# EAGLE design adapter (EAGLE 9.2.1)
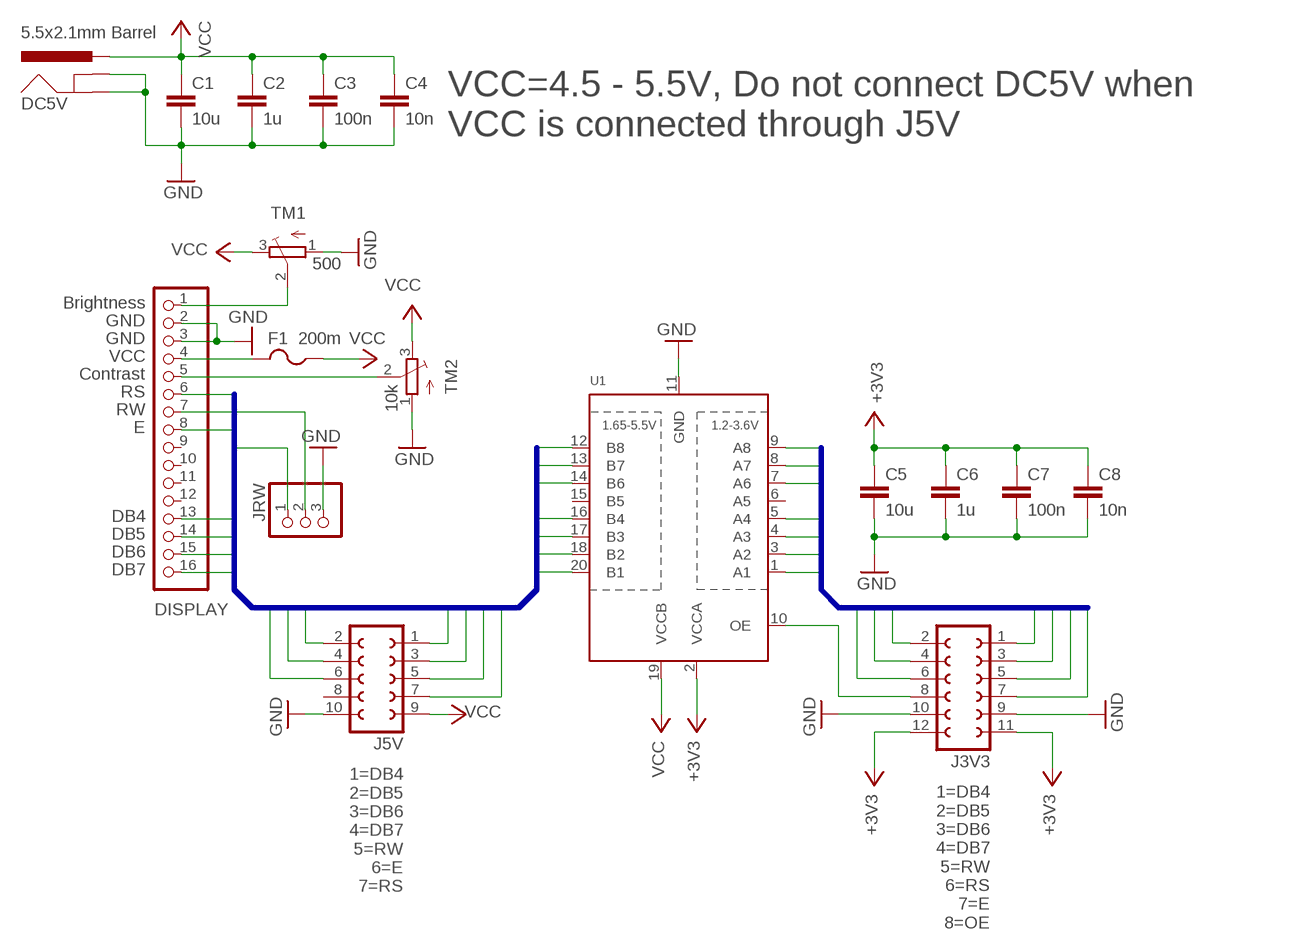
[diagram p0: schematic, sheet 1]

## Parts
C1  10u  C-EUC0603  [C0603]
C2  1u  C-EUC0603  [C0603]
C3  100n  C-EUC0603  [C0603]
C4  10n  C-EUC0603  [C0603]
C5  10u  C-EUC0603  [C0603]
C6  1u  C-EUC0603  [C0603]
C7  100n  C-EUC0603  [C0603]
C8  10n  C-EUC0603  [C0603]
DC5V  5.5x2.1mm Barrel  POWER_JACKSMD  [POWER_JACK_SMD]
DISPLAY  PINHD-1X16  [1X16]
F1  200m  PTCFUSE-1206  [R1206]
J3V3  FE06-2W  [FE06-2W]
J5V  FE05-2W  [FE05-2W]
JRW  PINHD-1X3/90  [1X03/90]
TM1  500  TRIMPOTTC33X  [TC33X]
TM2  10k  TRIMPOTTC33X  [TC33X]
U1  TXB0108PWR  [TSSOP20]

## Nets
3DB4: J3V3.1 U1.1(A1)
3DB5: J3V3.2 U1.3(A2)
3DB6: J3V3.3 U1.4(A3)
3DB7: J3V3.4 U1.5(A4)
3E: J3V3.7 U1.9(A8)
3RS: J3V3.6 U1.8(A7)
3RW: J3V3.5 U1.7(A6)
+3V3: C5.1 C6.1 C7.1 C8.1 J3V3.11 J3V3.12 U1.2(VCCA)
DB4: DISPLAY.13 J5V.1 U1.20(B1)
DB5: DISPLAY.14 J5V.2 U1.18(B2)
DB6: DISPLAY.15 J5V.3 U1.17(B3)
DB7: DISPLAY.16 J5V.4 U1.16(B4)
E: DISPLAY.8 J5V.6 U1.12(B8)
GND: C1.2 C2.2 C3.2 C4.2 C5.2 C6.2 C7.2 C8.2 DC5V.GND(GNDBREAK) DC5V.P$4(GND) DISPLAY.2 DISPLAY.3 J3V3.9 J3V3.10 J5V.10 JRW.3 TM1.1(A) TM2.1(A) U1.11(GND)
N$1: DISPLAY.5 TM2.2(S)
N$2: DISPLAY.1 TM1.2(S)
N$3: DISPLAY.4 F1.2
N$4: DISPLAY.7 JRW.2
N$7: J3V3.8 U1.10(OE)
RS: DISPLAY.6 J5V.7 U1.13(B7)
RW: J5V.5 JRW.1 U1.14(B6)
VCC: C1.1 C2.1 C3.1 C4.1 DC5V.VIN0(PWR) F1.1 J5V.9 TM1.3(E) TM2.3(E) U1.19(VCCB)
Unconnected: DISPLAY.9 DISPLAY.10 DISPLAY.11 DISPLAY.12 J5V.8 U1.6(A5) U1.15(B5)

## Buses
DB[4..7],E,RS,RW
3DB[4..7],3E,3RS,3RW

## Notes on the sheet
- VCC=4.5 - 5.5V, Do not connect DC5V when
  VCC is connected through J5V
- Brightness
- GND
- GND
- VCC
- Contrast
- RS
- RW
- E
- DB4
- DB5
- DB6
- DB7
- 1=DB4
  2=DB5
  3=DB6
  4=DB7
  5=RW
  6=E
  7=RS
- 1=DB4
  2=DB5
  3=DB6
  4=DB7
  5=RW
  6=RS
  7=E
  8=OE

## Library data of the parts
C1-C8 = rcl:C-EU: CAPACITOR, European symbol; SPICEPREFIX: C
DC5V = SparkFun-Connectors:POWER_JACK: Power Jack Connector This is the standard 5.5mm barrel jack for power. The PTH is the most common, proven, reliable, footprint. The Slot footprint only works if the mill layer is transmitted to the PCB fab house so be warned. Here are the connectors we sell at SparkFun: DC Barrel Power Jack/Connector <https://www.sparkfun.com/products/119> (PRT-00119) DC Barrel Power Jack/Connector (SMD) <https://www.sparkfun.com/products/12748> (PRT-12748) DC Barrel Jack Adapter - Breadboard Compatible <https://www.sparkfun.com/products/10811> (PRT-10811) It is used on this SparkFun product (and many, many others): SparkFun RedBoard - Programmed with Arduino <https://www.sparkfun.com/products/12757> (DEV-12757) Also, if you need a mating power supply or connector, please check these out: Wall Adapter Power Supply - 9VDC 650mA <https://www.sparkfun.com/products/298> (TOL-00298) DC Barrel Jack Adapter - Male <https://www.sparkfun.com/products/10287> (PRT-10287); PROD_ID: CONN-08106; SF_ID: PRT-12748
DISPLAY = pinhead:PINHD-1X16: PIN HEADER
F1 = adafruit:PTCFUSE: PTC fuses, resettable thermistors
J3V3 = con-lsta:FE06-2W: FEMALE HEADER; OC_FARNELL: unknown; OC_NEWARK: unknown
J5V = con-lsta:FE05-2W: FEMALE HEADER; OC_FARNELL: unknown; OC_NEWARK: unknown
JRW = pinhead:PINHD-1X3: PIN HEADER
TM1 TM2 = adafruit:TRIMPOT: SMT trimmer potentiometer part number TC33X http://www.ladyada.net/library/eagle
U1 = adafruit:TXB0108PWR: 8-Bit Bi-Directional Level Shifter 1.2V-3.6V (VCCA) to 1.65V-5.5V (VCCB) bi-directional level shifter with auto direction sensing. Max data rate - VCCA 1.8V: 20Mbps (50ns), VCCA 3.3V: 100Mbps (10ns) Digikey: 296-21527-1-ND

## Board
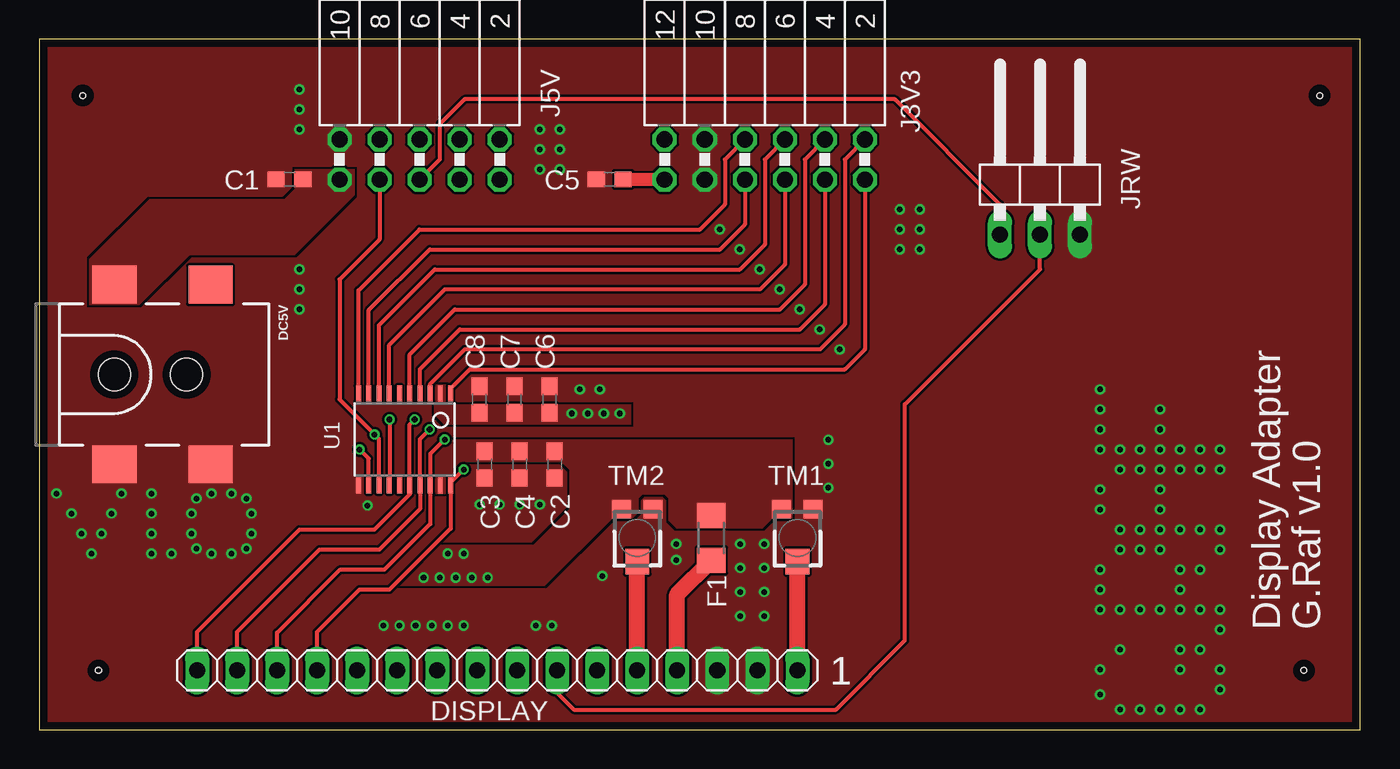
[diagram p1: board, top side]
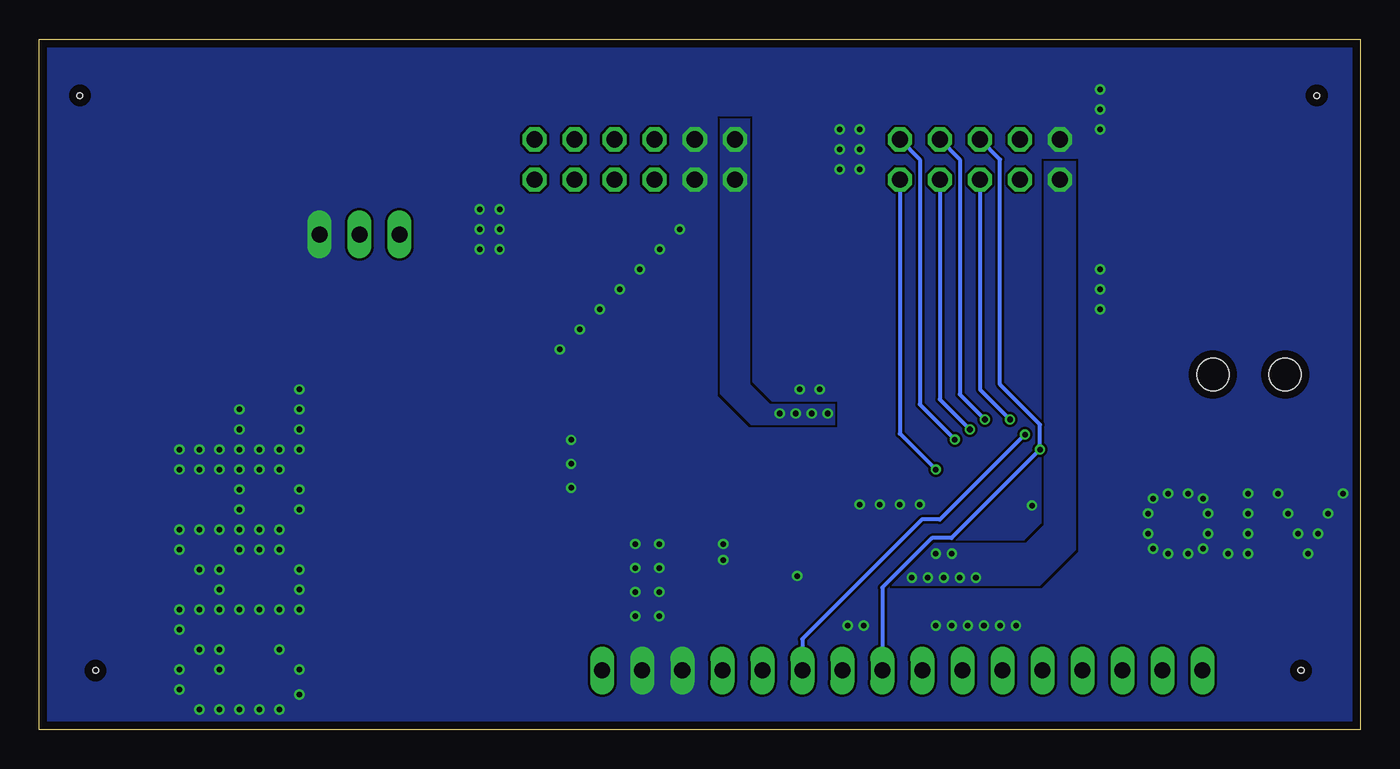
[diagram p2: board, bottom side, seen from below]

Size 83.82 x 43.81 mm. Coordinates in mm from the lower left corner, seen from the top.
Outline: 0,0 83.82,0 83.82,43.81 0,43.81 0,0
Copper layers (1*16): Top 0.035mm / dielectric 1.6mm / Bottom 0.035mm
Design rules "Elecrow_2-layer_PCB_eagle_rule": minimum track width 6mil, minimum drill 12mil, track to track 6mil, track to pad 8mil, pad to pad 12mil, via to via 12mil, smd to smd 0mil, copper to edge 20mil, drill to drill 10mil, minimum pad ring 6mil, minimum via ring 6mil, stop-mask expansion 0mil, vias tented up to drill 100mil, thermal gap 10mil
Holes 0.35 mm at 3.75,3.75 2.75,40.25 80.25,3.75 81.25,40.25

### Footprints (pad centres in the part's own frame; a part is rotated, then mirrored left to right if it is on the bottom)
C0603 = smd 1.1 x 1: 1 -0.85,0; 2 0.85,0
POWER_JACK_SMD = smd 2.8 x 2.4: GND 0,-5.7; P$4 6.1,-5.7; VIN0 0,5.7; VIN1 6.1,5.7 | hole 2.032: 0,0; 4.572,0
1X16 = drill 1.016 long: 1 -19.05,0; 2 -16.51,0; 3 -13.97,0; 4 -11.43,0; 5 -8.89,0; 6 -6.35,0; 7 -3.81,0; 8 -1.27,0; 9 1.27,0; 10 3.81,0; 11 6.35,0; 12 8.89,0; 13 11.43,0; 14 13.97,0; 15 16.51,0; 16 19.05,0
R1206 = smd 1.6 x 1.803: 1 -1.422,0; 2 1.422,0
FE06-2W = drill 1.016 octagon: 1 -6.35,1.27; 2 -6.35,-1.27; 3 -3.81,1.27; 4 -3.81,-1.27; 5 -1.27,1.27; 6 -1.27,-1.27; 7 1.27,1.27; 8 1.27,-1.27; 9 3.81,1.27; 10 3.81,-1.27; 11 6.35,1.27; 12 6.35,-1.27
FE05-2W = drill 1.016 octagon: 1 -5.08,1.27; 2 -5.08,-1.27; 3 -2.54,1.27; 4 -2.54,-1.27; 5 0,1.27; 6 0,-1.27; 7 2.54,1.27; 8 2.54,-1.27; 9 5.08,1.27; 10 5.08,-1.27
1X03/90 = drill 1.016 long: 1 -2.54,-3.81; 2 0,-3.81; 3 2.54,-3.81
TC33X = smd 1.2 x 1.2: 1 -1,-1.825; 3 1,-1.825 | smd 1.5 x 1.6: 2 0,1.5
TSSOP20 = smd 0.305 x 0.991: 1 -2.925,-2.918; 2 -2.275,-2.918; 3 -1.625,-2.918; 4 -0.975,-2.918; 5 -0.325,-2.918; 6 0.325,-2.918; 7 0.975,-2.918; 8 1.625,-2.918; 9 2.275,-2.918; 10 2.925,-2.918; 11 2.925,2.918; 12 2.275,2.918; 13 1.625,2.918; 14 0.975,2.918; 15 0.325,2.918; 16 -0.325,2.918; 17 -0.975,2.918; 18 -1.625,2.918; 19 -2.275,2.918; 20 -2.925,2.918

### Placement (x,y rotation side)
C1  15.88,34.92 180 top
C2  32.7,16.83 270 top
C3  28.26,16.83 270 top
C4  30.48,16.83 270 top
C5  36.2,34.92 180 top
C6  32.38,20.95 90 top
C7  30.16,20.95 90 top
C8  27.94,20.95 90 top
DC5V  4.76,22.54 0 top
DISPLAY  29.05,3.75 180 top
F1  42.65,12.16 270 top
J3V3  46.04,36.2 180 top
J5V  24.13,36.2 180 top
JRW  63.5,35.24 0 top
TM1  48.11,12.16 180 top
TM2  37.95,12.16 180 top
U1  23.18,18.41 180 top

### Tracks (layer width: path | path; a pad name or v marks a point on that pad's centre or on a via)
3DB4
  Top 0.254: J3V3.1 52.39,24.13 51.12,22.86 27.3,22.86 26.1,21.66 U1.1
3DB5
  Top 0.254: J3V3.2 51.12,36.2 51.12,25.72 49.53,24.13 26.99,24.13 24.8,21.95 U1.3
3DB6
  Top 0.254: J3V3.3 49.85,26.99 48.26,25.4 26.67,25.4 24.15,22.88 U1.4
3DB7
  Top 0.254: J3V3.4 48.58,36.2 48.58,28.26 46.99,26.67 26.35,26.67 23.5,23.82 U1.5
3E
  Top 0.254: J3V3.7 44.77,32.07 43.18,30.48 24.77,30.48 20.9,26.62 U1.9
3RS
  Top 0.254: J3V3.6 46.04,36.2 46.04,30.8 44.45,29.21 25.08,29.21 21.55,25.68 U1.8
3RW
  Top 0.254: J3V3.5 47.31,29.53 45.72,27.94 25.72,27.94 22.2,24.43 U1.7
+3V3  (via drill 0.35)
  Top 0.813: J3V3.11 C5.1
  other vias: 33.78,20.07 34.8,20.07 35.81,20.07 36.83,20.07
  pour Top (no thermals): 25.08,21.91 26.04,21.91 26.04,20.95 26.35,20.64 37.53,20.64 37.53,19.37 25.72,19.37 25.08,20
  pour Bottom (no thermals): 40.64,38.73 40.64,21.34 38.67,19.37 33.34,19.37 33.34,20.64 37.47,20.64 38.73,21.91 38.73,38.73
DB4  (via drill 0.35)
  Top 0.254: v26.92,16.51 26.1,15.69 U1.20 26.1,12.77 22.23,8.89 20.32,8.89 17.62,6.19 DISPLAY.13
  Bottom 0.254: J5V.1 29.21,18.8 v26.92,16.51
DB5  (via drill 0.35)
  Top 0.254: v25.72,18.41 24.8,17.5 U1.18 24.8,13.05 21.91,10.16 19.1,10.16 15.08,6.14 DISPLAY.14
  Bottom 0.254: J5V.2 27.94,36.2 27.94,20.64 v25.72,18.41
DB6  (via drill 0.35)
  Top 0.254: v24.77,19.05 24.15,18.44 U1.17 24.15,13.99 21.59,11.43 17.78,11.43 12.54,6.19 DISPLAY.15
  Bottom 0.254: J5V.3 26.67,20.95 v24.77,19.05
DB7  (via drill 0.35)
  Top 0.254: v23.81,19.68 23.5,19.38 U1.16 23.5,14.93 21.27,12.7 16.51,12.7 10,6.19 DISPLAY.16
  Bottom 0.254: J5V.4 25.4,36.2 25.4,21.27 v23.81,19.68
E  (via drill 0.35)
  Top 0.254: U1.12 20.9,17.2 v20.32,17.78
  Bottom 0.254: J5V.6 22.86,36.2 22.86,21.91 20.32,19.37 v20.32,17.78 25.94,12.16 27.18,12.16 30.32,9.02 DISPLAY.8
GND  (via drill 0.35)
  other vias: 50.8,24.13 49.53,25.4 48.26,26.67 46.99,27.94 45.72,29.21 44.45,30.48 43.18,31.75 73.66,1.27 74.93,2.54 72.39,1.27 71.12,1.27 69.85,1.27 68.58,1.27 67.31,2.22 67.31,3.81 68.58,5.08 74.93,3.81 73.66,5.08 72.39,5.08 72.39,3.81 74.93,6.35 74.93,7.62 73.66,7.62 72.39,7.62 71.12,7.62 69.85,7.62 68.58,7.62 67.31,7.62 67.31,8.89 67.31,10.16 68.58,11.43 69.85,11.43 71.12,11.43 72.39,10.16 72.39,8.89 73.66,10.16 74.93,11.43 74.93,12.7 73.66,12.7 72.39,12.7 71.12,12.7 69.85,12.7 68.58,12.7 67.31,13.97 67.31,15.24 68.58,16.51 69.85,16.51 71.12,16.51 72.39,16.51 73.66,16.51 74.93,16.51 71.12,13.97 71.12,15.24 74.93,17.78 73.66,17.78 72.39,17.78 71.12,17.78 69.85,17.78 68.58,17.78 67.31,17.78 67.31,19.05 67.31,20.32 67.31,21.59 71.12,19.05 71.12,20.32 27.94,14.29 30.48,14.29 29.21,14.29 31.75,14.29 34.29,21.59 35.56,21.59 31.75,36.83 31.75,35.56 33.02,35.56 33.02,36.83 33.02,38.1 31.75,38.1 3.3,11.18 3.94,12.45 2.67,12.45 2.03,13.72 4.57,13.72 5.21,14.99 1.08,14.99 7.11,14.99 7.11,13.72 7.11,12.45 7.11,11.18 21.84,6.6 44.49,7.21 44.49,11.78 46.01,11.78 8.38,11.18 9.97,11.49 10.92,11.18 9.65,12.45 12.19,11.18 13.14,11.49 13.46,12.45 13.46,13.72 13.14,14.67 12.19,14.99 10.92,14.99 9.97,14.67 9.65,13.72 46.01,10.26 44.49,10.26 44.49,8.74 46.01,7.21 50.08,15.34 50.08,16.86 50.08,18.39 54.61,33.02 55.88,33.02 55.88,31.75 54.61,31.75 54.61,30.48 55.88,30.48 16.51,29.21 16.51,27.94 16.51,26.67 16.51,38.1 16.51,39.37 16.51,40.64 46.01,8.74 22.86,6.6 23.88,6.6 24.89,6.6 25.91,6.6 26.92,6.6 40.42,11.78 40.42,10.77 35.73,9.75 32.51,6.6 31.5,6.6 20.83,14.22
  pour Top (rank 2, no thermals): 0,43.81 0,0 83.82,0 83.82,43.81
  pour Bottom (rank 3, no thermals): 0,43.82 0,0 83.82,0 83.82,43.82
N$1
  Top 1.016: DISPLAY.5 37.94,10.64 37.89,10.65 TM2.2
N$2
  Top 1.016: DISPLAY.1 48.1,10.64 48.05,10.65 TM1.2
N$3
  Top 1.016: DISPLAY.4 40.48,8.58 F1.2
N$4
  Top 0.254: JRW.2 63.5,29.21 54.93,20.64 54.93,5.65 50.55,1.27 33.93,1.27 32.86,2.34 DISPLAY.7
N$7
  Top 0.254: J3V3.8 43.5,36.2 43.5,33.34 41.91,31.75 24.13,31.75 20.25,27.87 U1.10
RS  (via drill 0.35)
  Top 0.254: J5V.7 21.59,31.11 19.05,28.57 19.05,20.95 v21.27,18.73 21.55,18.45 U1.13
  Bottom 0.254: v21.27,18.73 26.67,13.34 27.81,13.34 35.4,5.75 DISPLAY.6
RW  (via drill 0.35)
  Top 0.254: J5V.5 25.4,36.2 25.4,38.42 26.99,40.01 54.29,40.01 60.96,33.34 JRW.1 | v22.23,19.68 22.23,15.52 U1.14
  Bottom 0.254: J5V.5 24.13,21.59 v22.23,19.68
VCC  (via drill 0.35)
  other vias: 25.91,11.18 26.92,11.18 26.42,9.65 25.4,9.65 24.38,9.65 27.43,9.65 28.45,9.65
  pour Top (no thermals): 3.17,26.99 6.35,26.99 9.53,30.16 16.19,30.16 20,33.97 20,35.56 16.19,35.56 16.19,34.29 15.56,33.66 6.99,33.66 3.17,29.84
  pour Bottom (no thermals): 18.03,36.07 20.07,36.07 20.07,12.95 21.21,11.81 27.05,11.81 29.71,9.15 29.71,9.14 20.32,9.14 18.03,11.43
  pour Top (no thermals): 22.73,9.14 32.07,9.14 36.36,13.44 37.63,13.44 38.01,13.82 38.01,14.71 38.27,14.96 39.66,14.96 39.92,14.71 39.92,13.31 40.42,12.8 45.88,12.8 46.52,13.44 47.79,13.44 47.79,18.39 26.14,18.39 25.02,17.27 25.02,14.99 25.91,14.99 25.91,15.88 27.05,17.02 33.15,17.02 33.66,16.51 33.66,13.97 31.37,11.68 25.27,11.68

### Text on the board
tNames: Display Adapter | G.Raf v1.0 | 1